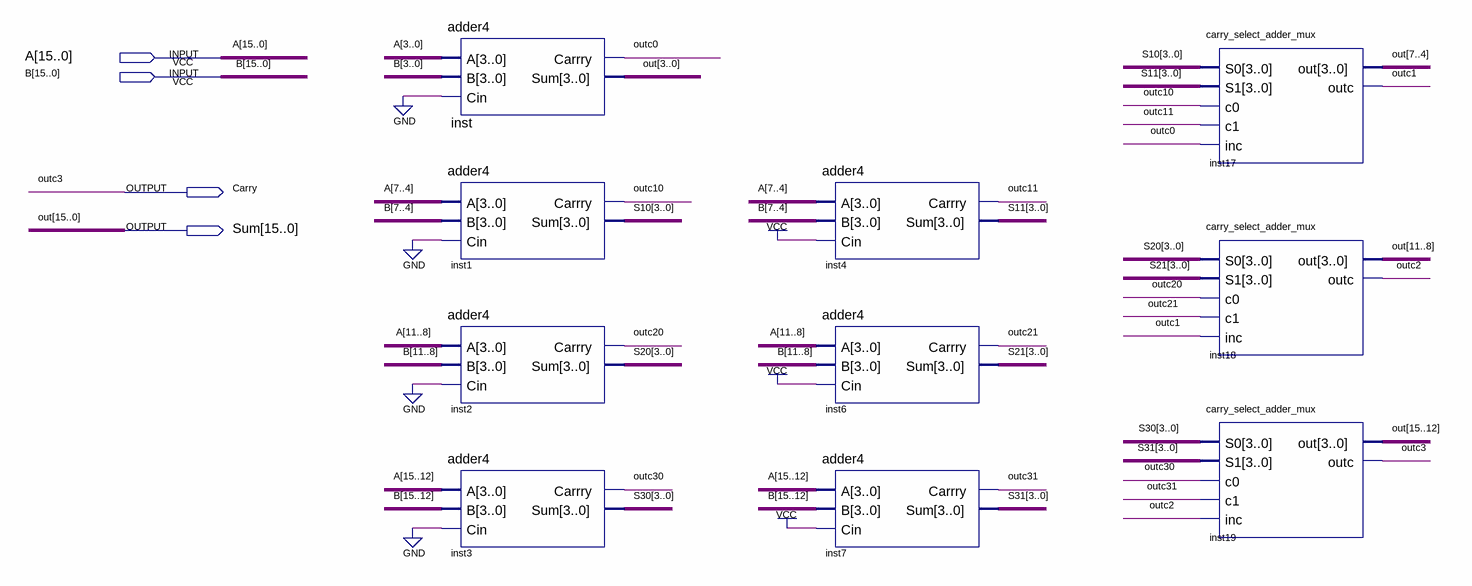
[diagram p0: schematic sheet]
// Quartus schematic carry_select_adder16.bdf as structural Verilog: 10 symbols, 4 pins
module carry_select_adder16 (
  input  [15:0] A,
  input  [15:0] B,
  output Carry,
  output [15:0] Sum
);

  wire outc0, outc1, outc2, outc10, outc11, outc20, outc21, outc30, outc31;
  wire [3:0] S10, S11, S20, S21, S30, S31;

  adder4 inst (.A(A[3:0]), .B(B[3:0]), .Cin(1'b0), .Carrry(outc0), .Sum(Sum[3:0]));
  adder4 inst1 (.A(A[7:4]), .B(B[7:4]), .Cin(1'b0), .Carrry(outc10), .Sum(S10));
  adder4 inst2 (.A(A[11:8]), .B(B[11:8]), .Cin(1'b0), .Carrry(outc20), .Sum(S20));
  adder4 inst3 (.A(A[15:12]), .B(B[15:12]), .Cin(1'b0), .Carrry(outc30), .Sum(S30));
  adder4 inst4 (.A(A[7:4]), .B(B[7:4]), .Cin(1'b1), .Carrry(outc11), .Sum(S11));
  adder4 inst6 (.A(A[11:8]), .B(B[11:8]), .Cin(1'b1), .Carrry(outc21), .Sum(S21));
  adder4 inst7 (.A(A[15:12]), .B(B[15:12]), .Cin(1'b1), .Carrry(outc31), .Sum(S31));
  carry_select_adder_mux inst17 (
    .S0(S10), .S1(S11), .c0(outc10), .c1(outc11), .inc(outc0), .out(Sum[7:4]), .outc(outc1));
  carry_select_adder_mux inst18 (
    .S0(S20), .S1(S21), .c0(outc20), .c1(outc21), .inc(outc1), .out(Sum[11:8]), .outc(outc2));
  carry_select_adder_mux inst19 (
    .S0(S30), .S1(S31), .c0(outc30), .c1(outc31), .inc(outc2), .out(Sum[15:12]), .outc(Carry));

  // Other names for the same wires on the sheet: out[15:0] = Sum; outc3 = Carry
endmodule
